# EAGLE schematic rtclock (EAGLE 5.11)
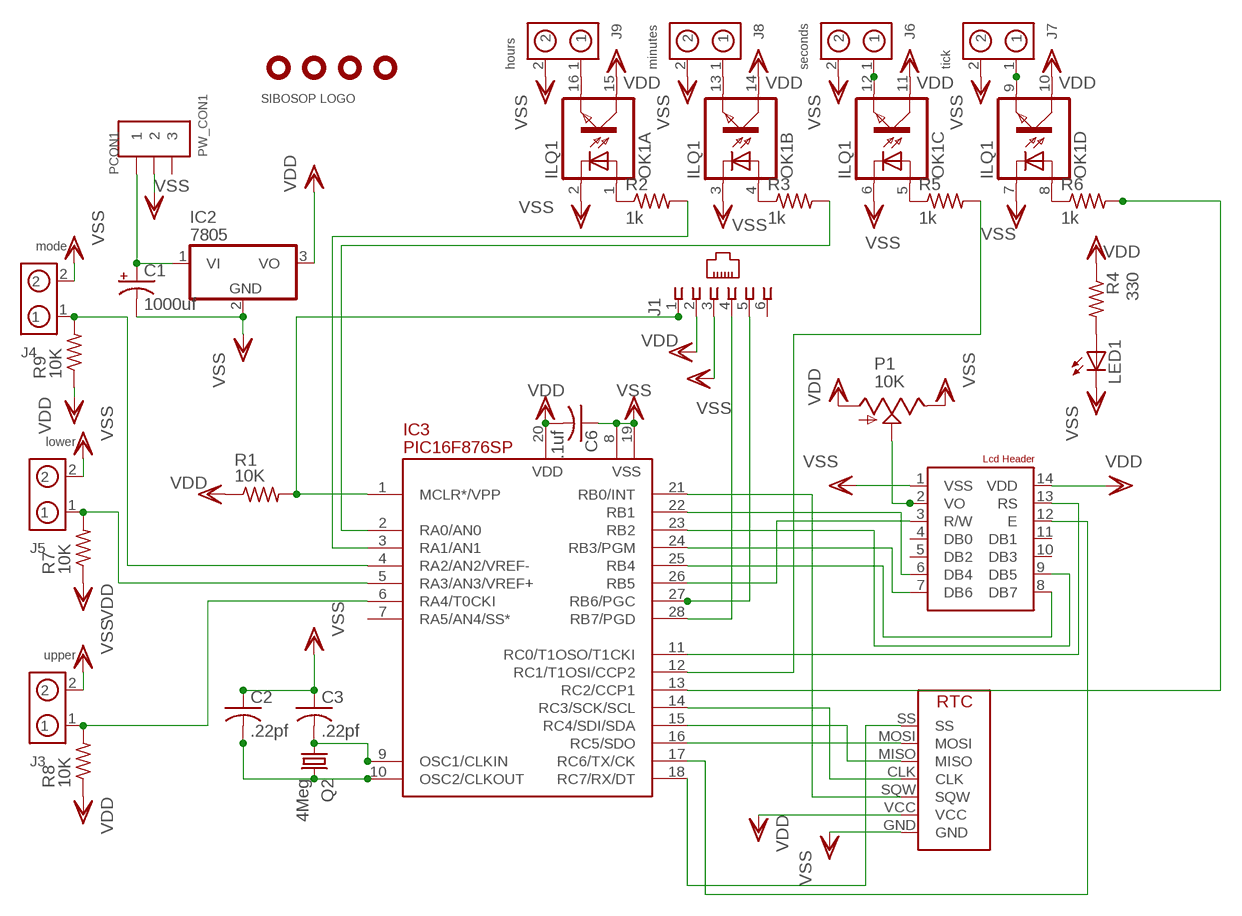
[diagram p0: schematic, sheet 1]

## Parts
C1  1000uf  CPOL-USE3.5-10  [E3,5-10]
C2  .22pf  C-US025-024X044  [C025-024X044]
C3  .22pf  C-US025-024X044  [C025-024X044]
C6  .1uf  C-US025-024X044  [C025-024X044]
H1  Display  LCDHEADER  [DIL14]
IC1  SPARKRTC  [SPARKRTC]
IC2  7805  [TO220V]
IC3  PIC16F876SP  [DIL28-3]
J1  520250-3  [520250-3]
J3  upper  MOLEX-2PIN-BASE  [MOLEX-001-2PIN]
J4  mode  MOLEX-2PIN-BASE  [MOLEX-001-2PIN]
J5  lower  MOLEX-2PIN-BASE  [MOLEX-001-2PIN]
J6  seconds  MOLEX-2PIN-BASE  [MOLEX-001-2PIN]
J7  tick  MOLEX-2PIN-BASE  [MOLEX-001-2PIN]
J8  minutes  MOLEX-2PIN-BASE  [MOLEX-001-2PIN]
J9  hours  MOLEX-2PIN-BASE  [MOLEX-001-2PIN]
LED1  LEDSQR2X5  [LED2X5]
OK1  ILQ1  [DIL16]
P1  10K  TRIMPOT  [RJ6S]
PCON1  PW_CON1  [PW_CON1]
Q2  4Meg  CRYSTALHC49S  [HC49/S]
R1  10K  R-US_0204/2V  [0204V]
R2  1k  R-US_0204/5  [0204/5]
R3  1k  R-US_0204/5  [0204/5]
R4  330  R-US_0204/2V  [0204V]
R5  1k  R-US_0204/5  [0204/5]
R6  1k  R-US_0204/5  [0204/5]
R7  10K  R-US_0204/2V  [0204V]
R8  10K  R-US_0204/2V  [0204V]
R9  10K  R-US_0204/2V  [0204V]
U$1  HOLE-125  [HOLE-125]
U$2  HOLE-125  [HOLE-125]
U$3  LOGO  [LOGO]
U$5  HOLE-125  [HOLE-125]
U$7  HOLE-125  [HOLE-125]

## Nets
N$1: IC3.1(MCLR*/VPP) J1.1 R1.2
N$2: C1.+ IC2.1(VI) PCON1.P$1
N$3: C2.2 IC3.10(OSC2/CLKOUT) Q2.2
N$4: C3.2 IC3.9(OSC1/CLKIN) Q2.1
N$5: IC1.SQW IC3.21(RB0/INT)
N$6: IC1.CLK IC3.14(RC3/SCK/SCL)
N$7: IC1.MISO IC3.15(RC4/SDI/SDA)
N$8: IC1.MOSI IC3.16(RC5/SDO)
N$9: IC1.SS IC3.18(RC7/RX/DT)
N$10: H1.13(RS) IC3.11(RC0/T1OSO/T1CKI)
N$11: H1.3(R/W) IC3.26(RB5)
N$12: H1.12(E) IC3.17(RC6/TX/CK)
N$13: H1.6(DB4) IC3.22(RB1)
N$14: IC3.27(RB6/PGC) J1.5
N$15: H1.9(DB5) IC3.23(RB2)
N$16: H1.7(DB6) IC3.24(RB3/PGM)
N$17: H1.8(DB7) IC3.25(RB4)
N$18: H1.2(VO) P1.S
N$19: J9.1 OK1.16(A:EMIT)
N$20: IC3.5(RA3/AN3/VREF+) J5.1 R7.2
N$21: IC3.28(RB7/PGD) J1.4
N$22: LED1.A R4.2
N$23: IC3.6(RA4/T0CKI) J3.1 R8.2
N$24: J8.1 OK1.13(B:EMIT)
N$28: J6.1 OK1.12(C:EMIT)
N$29: J7.1 OK1.9(D:EMIT)
N$30: OK1.1(A:A) R2.1
N$31: OK1.4(B:A) R3.1
N$32: OK1.5(C:A) R5.1
N$33: OK1.8(D:A) R6.1
N$34: IC3.13(RC2/CCP1) R6.2
N$35: IC3.12(RC1/T1OSI/CCP2) R5.2
N$36: IC3.2(RA0/AN0) R3.2
N$37: IC3.3(RA1/AN1) R2.2
N$38: IC3.4(RA2/AN2/VREF-) J4.1 R9.2
VDD: C6.2 H1.14(VDD) IC1.VCC IC2.3(VO) IC3.20(VDD) J1.2 OK1.10(D:COL) OK1.11(C:COL) OK1.14(B:COL) OK1.15(A:COL) P1.A R1.1 R4.1 R7.1 R8.1 R9.1
VSS: C1.- C2.1 C3.1 C6.1 H1.1(VSS) IC1.GND IC2.2(GND) IC3.8(VSS) IC3.19(VSS) J1.3 J3.2 J4.2 J5.2 J6.2 J7.2 J8.2 J9.2 LED1.K(C) OK1.2(A:C) OK1.3(B:C) OK1.6(C:C) OK1.7(D:C) P1.E PCON1.P$2
Unconnected: H1.4(DB0) H1.5(DB2) H1.10(DB3) H1.11(DB1) IC3.7(RA5/AN4/SS*) J1.6 PCON1.P$3

## Library data of the parts
C1 = rcl:CPOL-US: POLARIZED CAPACITOR, American symbol
C2 C3 C6 = rcl:C-US: CAPACITOR, American symbol
H1 = sibosop:LCDHEADER: 14 pin lcd header
IC1 = sibosop:SPARKRTC: spark fun deadon rtc breakout board
IC2 = kmarx1:78*: 78xx Family - Positive voltage regulator
IC3 = pic16f87x:PIC16F876: FLASH MICROCONTROLLER
J1 = con-amp:520250-3: AMP connector
J3-J9 = kmarx1:MOLEX-2PIN-BASE: Molex 2-pin header 22-03-2021,KK SERIES,FL,ST,TIN
LED1 = led:LED: LED OSRAM: - CHIPLED LG R971, LG N971, LY N971, LG Q971, LY Q971, LO R971, LY R971 LH N974, LH R974 LS Q976, LO Q976, LY Q976 LO Q996 - Hyper CHIPLED LW Q18S LB Q993, LB Q99A, LB R99A - SideLED LS A670, LO A670, LY A670, LG A670, LP A670 LB A673, LV A673, LT A673, LW A673 LH A674 LY A675 LS A676, LA A676, LO A676, LY A676, LW A676 LS A679, LY A679, LG A679 - Hyper Micro SIDELED® LS Y876, LA Y876, LO Y876, LY Y876 LT Y87S - SmartLED LW L88C, LW L88S LB L89C, LB L89S, LG L890 LS L89K, LO L89K, LY L89K LS L896, LA L896, LO L896, LY L896 - TOPLED LS T670, LO T670, LY T670, LG T670, LP T670 LSG T670, LSP T670, LSY T670, LOP T670, LYG T670 LG T671, LOG T671, LSG T671 LB T673, LV T673, LT T673, LW T673 LH T674 LS T676, LA T676, LO T676, LY T676, LB T676, LH T676, LSB T676, LW T676 LB T67C, LV T67C, LT T67C, LS T67K, LO T67K, LY T67K, LW E67C LS E67B, LA E67B, LO E67B, LY E67B, LB E67C, LV E67C, LT E67C LW T67C LS T679, LY T679, LG T679 LS T770, LO T770, LY T770, LG T770, LP T770 LB T773, LV T773, LT T773, LW T773 LH T774 LS E675, LA E675, LY E675, LS T675 LS T776, LA T776, LO T776, LY T776, LB T776 LHGB T686 LT T68C, LB T68C - Hyper Mini TOPLED® LB M676 - Mini TOPLED Santana® LG M470 LS M47K, LO M47K, LY M47K Source: http://www.osram.convergy.de - LUMILED® LXK2-PW12-R00, LXK2-PW12-S00, LXK2-PW14-U00, LXK2-PW14-V00 LXK2-PM12-R00, LXK2-PM12-S00, LXK2-PM14-U00 LXK2-PE12-Q00, LXK2-PE12-R00, LXK2-PE12-S00, LXK2-PE14-T00, LXK2-PE14-U00 LXK2-PB12-K00, LXK2-PB12-L00, LXK2-PB12-M00, LXK2-PB14-N00, LXK2-PB14-P00, LXK2-PB14-Q00 LXK2-PR12-L00, LXK2-PR12-M00, LXK2-PR14-Q00, LXK2-PR14-R00 LXK2-PD12-Q00, LXK2-PD12-R00, LXK2-PD12-S00 LXK2-PH12-R00, LXK2-PH12-S00 LXK2-PL12-P00, LXK2-PL12-Q00, LXK2-PL12-R00 Source: www.luxeon.com
OK1 = optocoupler:ILQ1: SIEMENS OPTO COUPLER; MF: VISHAY/TELEFUNKEN; MPN: ILQ1; OC_FARNELL: 1469501; OC_NEWARK: 88K1954
P1 = sibosop:TRIMPOT
PCON1 = powerconnectorskt:PW_CON1
Q2 = crystal:CRYSTAL: CRYSTAL
R1-R9 = rcl:R-US_: RESISTOR, American symbol
U$1 U$2 U$5 U$7 = sibosop:HOLE-125
U$3 = sibosop:LOGO